# Altium schematic sheet RS485.SchDoc
size A4
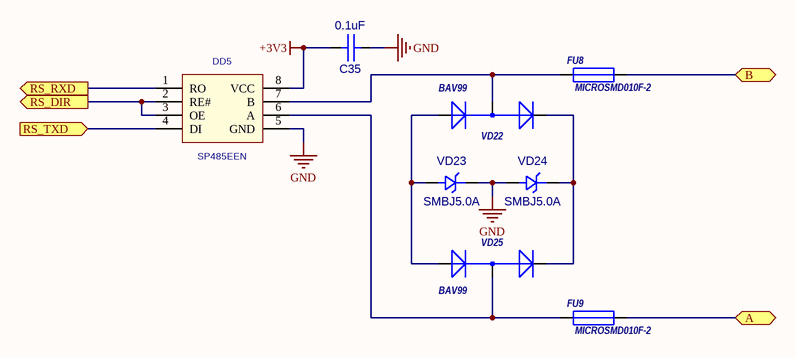
[diagram p0: RS485.SchDoc]

## Parts
C35  0.1uF  [CC0603]
DD5  SP485EEN  [SO-8]
FU8  MICROSMD010F-2  [RC1210]
FU9  MICROSMD010F-2  [RC1210]
VD22  BAV99  [SOT-23(GSD)]
VD23  SMBJ5.0A  [SMB]
VD24  SMBJ5.0A  [SMB]
VD25  BAV99  [SOT-23(GSD)]

## Ports
A, B, RS_DIR (out), RS_RXD (out), RS_TXD (in)

## Nets
+3V3: C35.2(B) DD5.8(VCC)
GND: C35.1(A) DD5.5(GND) VD23.2(K) VD24.1(A)
A: FU9.2 ; port A
B: FU8.2 ; port B
RS_DIR: DD5.2(RE#) DD5.3(OE) ; port RS_DIR
RS_RXD: DD5.1(RO) ; port RS_RXD
RS_TXD: DD5.4(DI) ; port RS_TXD
NetDD5_6: DD5.6(A) FU9.1 VD25.3(AK)
NetDD5_7: DD5.7(B) FU8.1 VD22.3(AK)
NetVD22_1: VD22.1(A) VD23.1(A) VD25.1(A)
NetVD22_2: VD22.2(K) VD24.2(K) VD25.2(K)

## Library data of the parts
C35 = CC0603: Value: 0.1uF
DD5 = SP485: Value: *
FU8 FU9 = MICROSMD: Value: MICROSMD010F-2
VD22 VD25 = BAV99: 1.0 Ampere General Purpose Rectifier; ComponentField6: Published 8-Jun-2000, Modified 11-July-2000: SIM Model Added.; Value: *
VD23 VD24 = SMBJ: Value: SMBJ5.0A